# EAGLE design AutoSteerAIO (EAGLE 9.6.1)
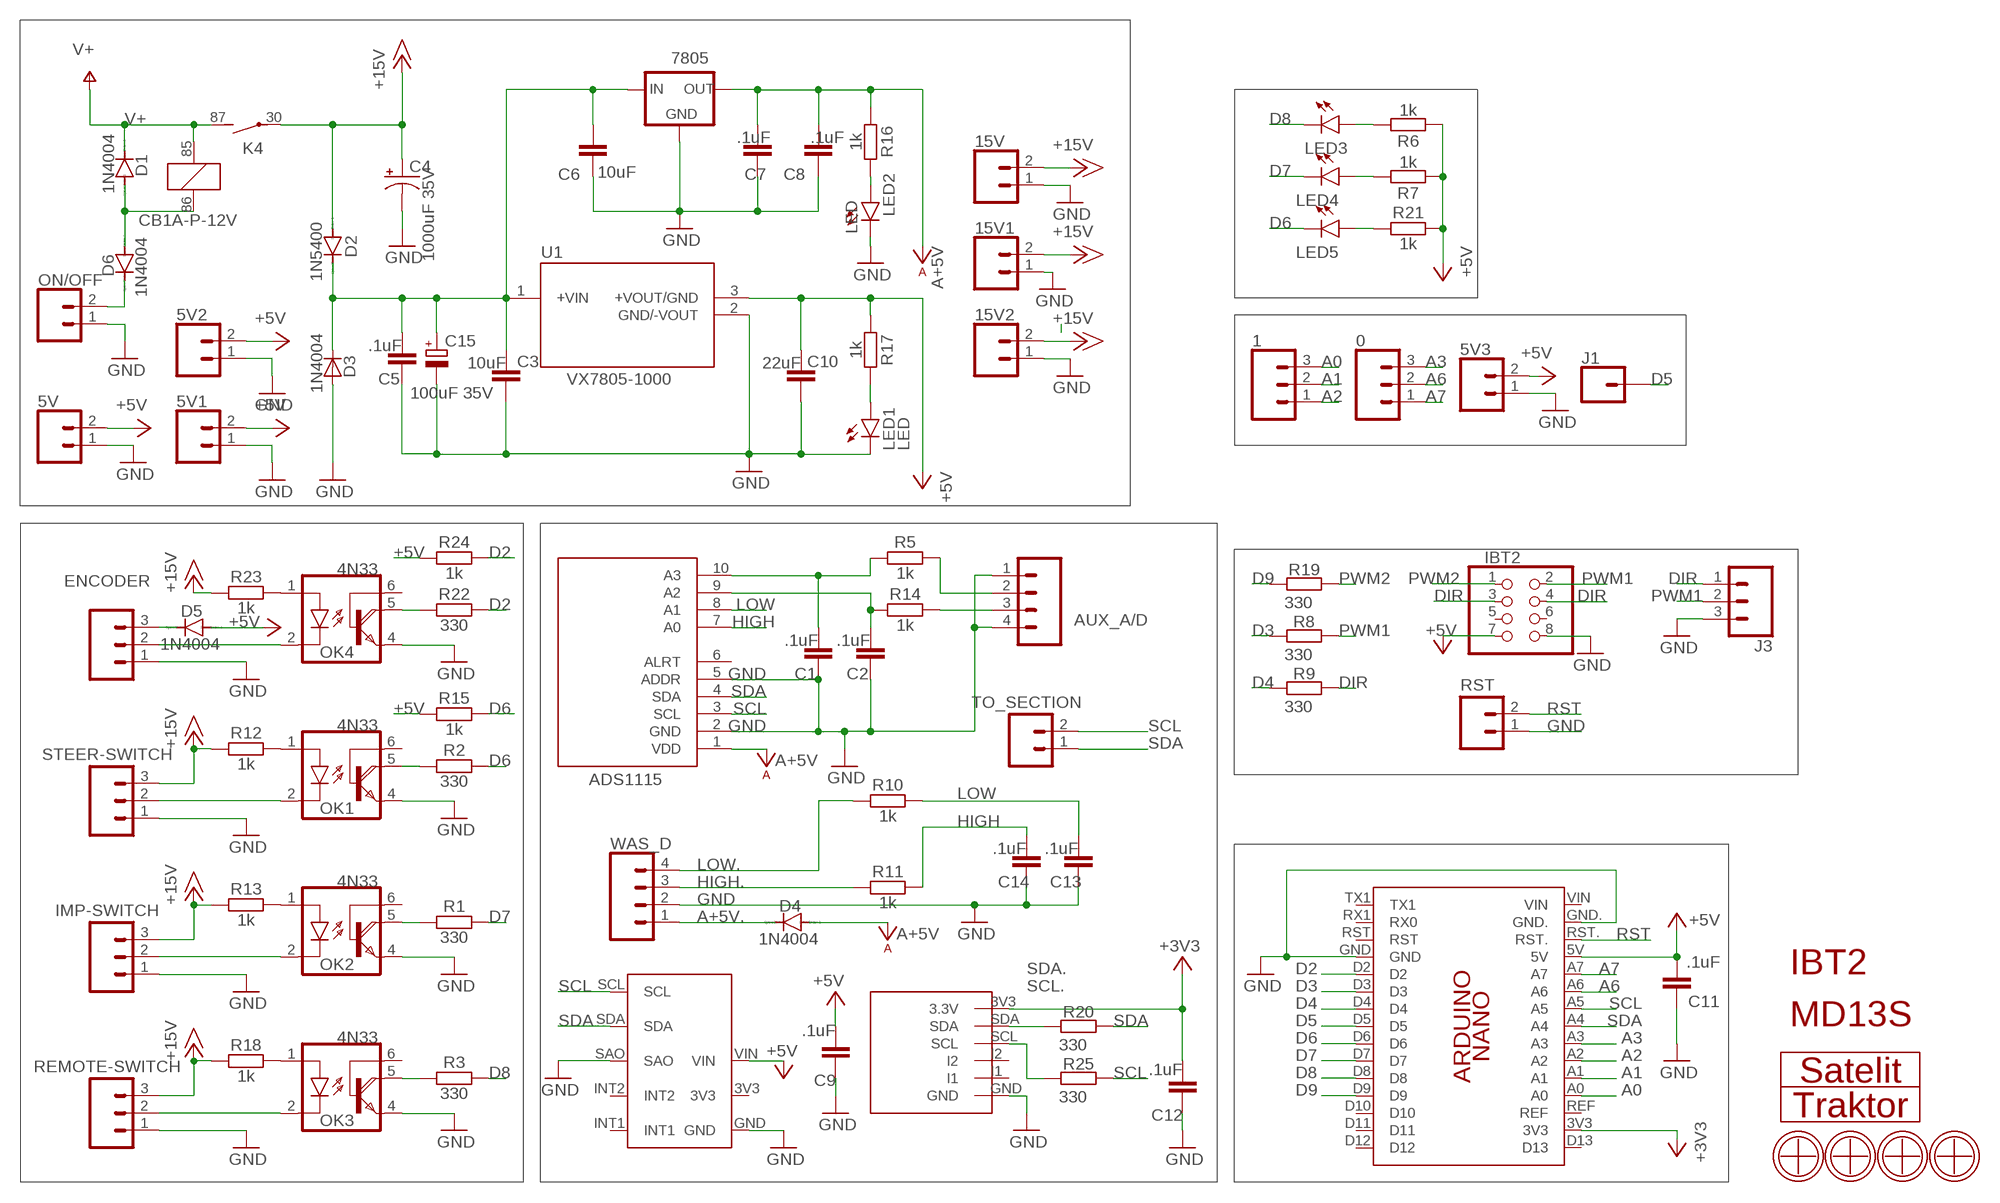
[diagram p0: schematic, sheet 1]

## Parts
0  CONNECTOR 1x2 PINS  CONN_03  [1X03]
1  CONNECTOR 1x2 PINS  CONN_03  [1X03]
5V  CONNECTOR 1x2 PINS  CONN_02  [1X02]
5V1  CONNECTOR 1x2 PINS  CONN_02  [1X02]
5V2  CONNECTOR 1x2 PINS  CONN_02  [1X02]
5V3  CONNECTOR 1x2 PINS  CONN_02  [1X02]
15V  CONNECTOR 1x2 PINS  CONN_02  [1X02]
15V1  CONNECTOR 1x2 PINS  CONN_02  [1X02]
15V2  CONNECTOR 1x2 PINS  CONN_02  [1X02]
7805  78XXS  [78XXS]
ADS1115  ADS1115  ADC-4CH-ADS1115  [ADC-4CH-ADS1115]
AUX_A/D  CONNECTOR 1x4 PINS  CONN_04  [1X04]
C1  .1uF  C-EU050-024X044  [C050-024X044]
C2  .1uF  C-EU050-024X044  [C050-024X044]
C3  10uF  C-EU050-024X044  [C050-024X044]
C4  1000uF 35V  1000UF-RADIAL-5MM-25V-20%  [CPOL-RADIAL-5MM-10MM]
C5  .1uF  C-EU050-024X044  [C050-024X044]
C6  10uF  C-EU050-024X044  [C050-024X044]
C7  .1uF  C-EU050-024X044  [C050-024X044]
C8  .1uF  C-EU050-024X044  [C050-024X044]
C9  .1uF  C-EU050-024X044  [C050-024X044]
C10  22uF  C-EU050-024X044  [C050-024X044]
C11  .1uF  C-EU050-024X044  [C050-024X044]
C12  .1uF  C-EU050-024X044  [C050-024X044]
C13  .1uF  C-EU050-024X044  [C050-024X044]
C14  .1uF  C-EU050-024X044  [C050-024X044]
C15  100uF 35V  CPOL-EUE2.5-6  [E2,5-6]
D1  1N4004  [DO41-10]
D2  1N5400  [DO201-15]
D3  1N4004  [DO41-10]
D4  1N4004  [DO41-10]
D5  1N4004  [DO41-10]
D6  1N4004  [DO41-10]
ENCODER  CONNECTOR 1x3 PINS  CONN_03  [1X03]
IBT2  PINHD-2X4  [2X04]
IMP-SWITCH  CONNECTOR 1x3 PINS  CONN_03  [1X03]
J1  CONN_01  [1X01]
J3  CONN_03  [1X03]
K4  CB1A-P-12V  [CB1]
LED1  LED  LED3MM  [LED3MM]
LED2  LED  LED3MM  [LED3MM]
LED3  LED  LED3MM  [LED3MM]
LED4  LED  LED3MM  [LED3MM]
LED5  LED  LED3MM  [LED3MM]
MMA8542  MMA8542  [MMA8452]
OK1  4N33  [DIL06]
OK2  4N33  [DIL06]
OK3  4N33  [DIL06]
OK4  4N33  [DIL06]
ON/OFF  CONNECTOR 1x2 PINS  CONN_02  [1X02]
PCB1  ARDUINO NANO v3  ARDUINO-NANO  [ARDUINO-NANO]
R1  330  R-EU_0207/7  [0207/7]
R2  330  R-EU_0207/7  [0207/7]
R3  330  R-EU_0207/7  [0207/7]
R5  1k  R-EU_0207/7  [0207/7]
R6  1k  R-EU_0207/7  [0207/7]
R7  1k  R-EU_0207/7  [0207/7]
R8  330  R-EU_0207/7  [0207/7]
R9  330  R-EU_0207/7  [0207/7]
R10  1k  R-EU_0207/7  [0207/7]
R11  1k  R-EU_0207/7  [0207/7]
R12  1k  R-EU_0207/7  [0207/7]
R13  1k  R-EU_0207/7  [0207/7]
R14  1k  R-EU_0207/7  [0207/7]
R15  1k  R-EU_0207/7  [0207/7]
R16  1k  R-EU_0207/7  [0207/7]
R17  1k  R-EU_0207/7  [0207/7]
R18  1k  R-EU_0207/7  [0207/7]
R19  330  R-EU_0207/7  [0207/7]
R20  330  R-EU_0207/7  [0207/7]
R21  1k  R-EU_0207/7  [0207/7]
R22  330  R-EU_0207/7  [0207/7]
R23  1k  R-EU_0207/7  [0207/7]
R24  1k  R-EU_0207/7  [0207/7]
R25  330  R-EU_0207/7  [0207/7]
REMOTE-SWITCH  CONNECTOR 1x3 PINS  CONN_03  [1X03]
RST  CONNECTOR 1x2 PINS  CONN_02  [1X02]
STEER-SWITCH  CONNECTOR 1x3 PINS  CONN_03  [1X03]
TO_SECTION  CONNECTOR 1x2 PINS  CONN_02  [1X02]
U1  VX7805-1000  [VX78012-1000_VX7805-1000]
U$1  MD13S  [MD13S]
U$2  IBT2  [IBT2]
U$5  TRAKTOR-MALI  [TRAKTOR-MALI]
U$6  4.2MM-6MM  [4.2MM-6MM]
U$7  4.2MM-6MM  [4.2MM-6MM]
U$8  SATELIT-MALI  [SATELIT-MALI]
U$9  4.2MM-6MM  [4.2MM-6MM]
U$10  4.2MM-6MM  [4.2MM-6MM]
U$13  MMA8542Q  [MMA8542Q]
WAS_D  CONNECTOR 1x4 PINS  CONN_04  [1X04]

## Nets
+3V3: C12.2 PCB1.3V3 U$13.3V3(3.3V)
+5V: 5V1.2 5V2.2 5V3.2 5V.2 C9.2 C10.2 C11.2 D5.A IBT2.7 MMA8542.VIN PCB1.5V R6.1 R7.1 R15.1 R17.1 R21.2 R24.1 U1.3(+VOUT/GND)
+15V: 15V1.2 15V2.2 15V.2 C4.+ D2.A IMP-SWITCH.3 K4.30(2:P) R12.1 R13.1 R18.1 R23.1 REMOTE-SWITCH.3 STEER-SWITCH.3
A0: 1.3 PCB1.A0
A1: 1.2 PCB1.A1
A2: 1.1 PCB1.A2
A3: 0.3 PCB1.A3
A6: 0.2 PCB1.A6
A7: 0.1 PCB1.A7
A+5V: 7805.OUT ADS1115.1(VDD) C7.2 C8.2 D4.A R16.1
A+5V.: D4.C WAS_D.1
D2: PCB1.D2 R22.2 R24.2
D3: PCB1.D3 R8.2
D4: PCB1.D4 R9.2
D5: J1.1 PCB1.D5
D6: LED5.K(C) PCB1.D6 R2.2 R15.2
D7: LED4.K(C) PCB1.D7 R1.2
D8: LED3.K(C) PCB1.D8 R3.2
D9: PCB1.D9 R19.2
DIR: IBT2.3 IBT2.4 J3.1 R9.1
GND: 5V1.1 5V2.1 5V3.1 5V.1 15V1.1 15V2.1 15V.1 7805.GND ADS1115.2(GND) ADS1115.5(ADDR) AUX_A/D.1 AUX_A/D.4 C1.1 C2.1 C3.1 C4.- C5.1 C6.1 C7.1 C8.1 C9.1 C10.1 C11.1 C12.1 C13.1 C14.1 C15.- D3.A ENCODER.1 IBT2.8 IMP-SWITCH.1 J3.3 LED1.K(C) LED2.K(C) MMA8542.GND MMA8542.SAO OK1.4(E) OK2.4(E) OK3.4(E) OK4.4(E) ON/OFF.1 PCB1.GND PCB1.GND. REMOTE-SWITCH.1 RST.1 STEER-SWITCH.1 U1.2(GND/-VOUT) U$13.GND WAS_D.2
HIGH: ADS1115.7(A0) C14.2 R11.2
HIGH.: R11.1 WAS_D.3
LOW: ADS1115.8(A1) C13.2 R10.2
LOW.: R10.1 WAS_D.4
N$1: D5.C ENCODER.3
N$2: OK1.5(COL) R2.1
N$3: OK1.2(C) STEER-SWITCH.2
N$4: IMP-SWITCH.2 OK2.2(C)
N$5: D1.A D6.A K4.86
N$6: OK2.5(COL) R1.1
N$7: ADS1115.10(A3) C1.2 R5.1
N$8: ADS1115.9(A2) C2.2 R14.1
N$9: ENCODER.2 OK4.2(C)
N$10: AUX_A/D.2 R5.2
N$11: AUX_A/D.3 R14.2
N$12: OK3.2(C) REMOTE-SWITCH.2
N$13: LED2.A R16.2
N$14: LED1.A R17.2
N$15: OK3.5(COL) R3.1
N$16: OK2.1(A) R13.2
N$17: OK3.1(A) R18.2
N$18: OK1.1(A) R12.2
N$22: LED3.A R6.2
N$23: LED5.A R21.1
N$26: 7805.IN C3.2 C5.2 C6.2 C15.+ D2.C D3.C U1.1(+VIN)
N$28: D6.C ON/OFF.2
N$29: OK4.5(COL) R22.1
N$30: OK4.1(A) R23.2
N$31: LED4.A R7.2
PWM1: IBT2.2 J3.2 R8.1
PWM2: IBT2.1 R19.1
RST: PCB1.RST. RST.2
SCL: ADS1115.3(SCL) MMA8542.SCL PCB1.A5 R25.1 TO_SECTION.2
SCL.: R25.2 U$13.SCL
SDA: ADS1115.4(SDA) MMA8542.SDA PCB1.A4 R20.1 TO_SECTION.1
SDA.: R20.2 U$13.SDA
V+: D1.C K4.85 K4.87(2:S) ; supply symbol labelled BAT V+
Unconnected: ADS1115.6(ALRT) IBT2.5 IBT2.6 MMA8542.3V3 MMA8542.INT1 MMA8542.INT2 OK1.6(B) OK2.6(B) OK3.6(B) OK4.6(B) PCB1.D10 PCB1.D11 PCB1.D12 PCB1.D13 PCB1.REF PCB1.RST PCB1.RX1(RX0) PCB1.TX1 PCB1.VIN U$6.P$1 U$7.P$1 U$9.P$1 U$10.P$1 U$13.I1 U$13.I2

## Library data of the parts
0 1 ENCODER IMP-SWITCH J3 REMOTE-SWITCH STEER-SWITCH = SparkFun-Connectors:CONN_03: Multi connection point. Often used as Generic Header-pin footprint for 0.1 inch spaced/style header connections On any of the 0.1 inch spaced packages, you can populate with these: Break Away Headers - Straight <https://www.sparkfun.com/products/116> (PRT-00116) Break Away Male Headers - Right Angle <https://www.sparkfun.com/products/553> (PRT-00553) Female Headers <https://www.sparkfun.com/products/115> (PRT-00115) Break Away Headers - Machine Pin <https://www.sparkfun.com/products/117> (PRT-00117) Break Away Female Headers - Swiss Machine Pin <https://www.sparkfun.com/products/743> (PRT-00743) Stackable Header - 3 Pin (Female, 0.1") <https://www.sparkfun.com/products/13875> (PRT-13875) For SCREWTERMINALS and SPRING TERMINALS visit here: Screw Terimnals on SparkFun.com <https://www.sparkfun.com/search/results?term=Screw+Terminals> (5mm/3.5mm/2.54mm spacing) This device is also useful as a general connection point to wire up your design to another part of your project. Our various solder wires solder well into these plated through hole pads. Hook-Up Wire - Assortment (Stranded, 22 AWG) <https://www.sparkfun.com/products/11375> (PRT-11375) Hook-Up Wire - Assortment (Solid Core, 22 AWG) <https://www.sparkfun.com/products/11367> (PRT-11367) View the entire wire category on our website here <https://www.sparkfun.com/categories/141> Special notes: Molex polarized connector foot print use with SKU : PRT-08232 with associated crimp pins and housings.; OC_NEWARK: unknown
5V 5V1-5V3 15V 15V1 15V2 ON/OFF RST TO_SECTION = SparkFun-Connectors:CONN_02: Multi connection point. Often used as Generic Header-pin footprint for 0.1 inch spaced/style header connections On any of the 0.1 inch spaced packages, you can populate with these: Break Away Headers - Straight <https://www.sparkfun.com/products/116> (PRT-00116) Break Away Male Headers - Right Angle <https://www.sparkfun.com/products/553> (PRT-00553) Female Headers <https://www.sparkfun.com/products/115> (PRT-00115) Break Away Headers - Machine Pin <https://www.sparkfun.com/products/117> (PRT-00117) Break Away Female Headers - Swiss Machine Pin <https://www.sparkfun.com/products/743> (PRT-00743) For SCREWTERMINALS and SPRING TERMINALS visit here: Screw Terimnals on SparkFun.com <https://www.sparkfun.com/search/results?term=Screw+Terminals> (5mm/3.5mm/2.54mm spacing) This device is also useful as a general connection point to wire up your design to another part of your project. Our various solder wires solder well into these plated through hole pads. Hook-Up Wire - Assortment (Stranded, 22 AWG) <https://www.sparkfun.com/products/11375> (PRT-11375) Hook-Up Wire - Assortment (Solid Core, 22 AWG) <https://www.sparkfun.com/products/11367> (PRT-11367) View the entire wire category on our website here <https://www.sparkfun.com/categories/141> Special notes: Molex polarized connector foot print use with: PRT-08233 with associated crimp pins and housings. 2.54_SCREWTERM for use with PRT-10571. 3.5mm Screw Terminal footprints for PRT-08084 5mm Screw Terminal footprints for use with PRT-08432; OC_NEWARK: unknown
7805 = v-reg:78XXS: VOLTAGE REGULATOR
ADS1115 = #Diy-modules:ADC-4CH-ADS1115: 4 Channel 16-Bit Analog-to-Digital Converter based on ADS1115 chip Arduino ADS1115 Getting Started Tutorial is available here: http://henrysbench.capnfatz.com/henrys-bench/arduino-voltage-measurements/arduino-ads1115-module-getting-started-tutorial/ ADS1115 datasheet is available here: http://www.ti.com/lit/ds/symlink/ads1115.pdf Click here to find device on ebay.com <http://www.ebay.com/sch/ads1115+module>; OC_NEWARK: unknown
AUX_A/D WAS_D = SparkFun-Connectors:CONN_04: Multi connection point. Often used as Generic Header-pin footprint for 0.1 inch spaced/style header connections On any of the 0.1 inch spaced packages, you can populate with these: Break Away Headers - Straight <https://www.sparkfun.com/products/116> (PRT-00116) Break Away Male Headers - Right Angle <https://www.sparkfun.com/products/553> (PRT-00553) Female Headers <https://www.sparkfun.com/products/115> (PRT-00115) Break Away Headers - Machine Pin <https://www.sparkfun.com/products/117> (PRT-00117) Break Away Female Headers - Swiss Machine Pin <https://www.sparkfun.com/products/743> (PRT-00743) For SCREWTERMINALS and SPRING TERMINALS visit here: Screw Terimnals on SparkFun.com <https://www.sparkfun.com/search/results?term=Screw+Terminals> (5mm/3.5mm/2.54mm spacing) This device is also useful as a general connection point to wire up your design to another part of your project. Our various solder wires solder well into these plated through hole pads. Hook-Up Wire - Assortment (Stranded, 22 AWG) <https://www.sparkfun.com/products/11375> (PRT-11375) Hook-Up Wire - Assortment (Solid Core, 22 AWG) <https://www.sparkfun.com/products/11367> (PRT-11367) View the entire wire category on our website here <https://www.sparkfun.com/categories/141> Special notes: Molex polarized connector foot print use with SKU : PRT-08231 with associated crimp pins and housings. 1MM SMD Version SKU: PRT-10208; OC_NEWARK: unknown; PROD_ID: CONN-09696
C1-C3 C5-C14 = resistor:C-EU: CAPACITOR, European symbol; OC_NEWARK: unknown
C4 = SparkFun-Capacitors:1000UF: 1,000µF/1mF ceramic capacitors A capacitor is a passive two-terminal electrical component used to store electrical energy temporarily in an electric field. CAP-08070; OC_NEWARK: unknown; PROD_ID: CAP-09538; VALUE: 1mF
C15 = rcl:CPOL-EU: POLARIZED CAPACITOR, European symbol; SPICEPREFIX: C
D1 D4-D6 = #Diode 2:1N4004: DIODE; OC_NEWARK: unknown
D2 = #Diode 2:1N5400: DIODE standard rectifier, 3 A, 50 V (Motorola); OC_NEWARK: unknown
D3 = #adafruit:1N4004: DIODE; OC_NEWARK: unknown
IBT2 = #pinhead:PINHD-2X4: PIN HEADER; OC_NEWARK: unknown
J1 = SparkFun-Connectors:CONN_01: Single connection point. Often used as Generic Header-pin footprint for 0.1 inch spaced/style header connections On any of the 0.1 inch spaced packages, you can populate with these: Break Away Headers - Straight <https://www.sparkfun.com/products/116> (PRT-00116) Break Away Male Headers - Right Angle <https://www.sparkfun.com/products/553> (PRT-00553) Female Headers <https://www.sparkfun.com/products/115> (PRT-00115) Break Away Headers - Machine Pin <https://www.sparkfun.com/products/117> (PRT-00117) Break Away Female Headers - Swiss Machine Pin <https://www.sparkfun.com/products/743> (PRT-00743) This device is also useful as a general connection point to wire up your design to another part of your project. Our various solder wires solder well into these plated through hole pads. Hook-Up Wire - Assortment (Stranded, 22 AWG) <https://www.sparkfun.com/products/11375> (PRT-11375) Hook-Up Wire - Assortment (Solid Core, 22 AWG) <https://www.sparkfun.com/products/11367> (PRT-11367) View the entire wire category on our website here <https://www.sparkfun.com/categories/141> Special notes: SMTSO-256-ET is a "flush mount" nut for a 4-40 screw. We mostly use this on specialty testbeds; it is a nice way to connect hardware to your PCB at an adjustable hieght. Also note, the SNAP packages are for using a snappable style connector. We sell a baggie of snaps and they are also used on two LilyPad designs: Snap Assortment - 30 pack (male and female) <https://www.sparkfun.com/products/11347> (DEV-11347) LilyPad Arduino SimpleSnap <https://www.sparkfun.com/products/10941> (DEV-10941) LilyPad SimpleSnap Protoboard <https://www.sparkfun.com/products/10940> (DEV-10940)
K4 = #relay:CB*: HIGH POWER AUTOMOTIVE RELAY Form A NAiS Source: http://www.mew-europe.com/.. en_ds_61202_0000.pdf
LED1-LED5 = led:LED: LED OSRAM: - CHIPLED LG R971, LG N971, LY N971, LG Q971, LY Q971, LO R971, LY R971 LH N974, LH R974 LS Q976, LO Q976, LY Q976 LO Q996 - Hyper CHIPLED LW Q18S LB Q993, LB Q99A, LB R99A - SideLED LS A670, LO A670, LY A670, LG A670, LP A670 LB A673, LV A673, LT A673, LW A673 LH A674 LY A675 LS A676, LA A676, LO A676, LY A676, LW A676 LS A679, LY A679, LG A679 - Hyper Micro SIDELED® LS Y876, LA Y876, LO Y876, LY Y876 LT Y87S - SmartLED LW L88C, LW L88S LB L89C, LB L89S, LG L890 LS L89K, LO L89K, LY L89K LS L896, LA L896, LO L896, LY L896 - TOPLED LS T670, LO T670, LY T670, LG T670, LP T670 LSG T670, LSP T670, LSY T670, LOP T670, LYG T670 LG T671, LOG T671, LSG T671 LB T673, LV T673, LT T673, LW T673 LH T674 LS T676, LA T676, LO T676, LY T676, LB T676, LH T676, LSB T676, LW T676 LB T67C, LV T67C, LT T67C, LS T67K, LO T67K, LY T67K, LW E67C LS E67B, LA E67B, LO E67B, LY E67B, LB E67C, LV E67C, LT E67C LW T67C LS T679, LY T679, LG T679 LS T770, LO T770, LY T770, LG T770, LP T770 LB T773, LV T773, LT T773, LW T773 LH T774 LS E675, LA E675, LY E675, LS T675 LS T776, LA T776, LO T776, LY T776, LB T776 LHGB T686 LT T68C, LB T68C - Hyper Mini TOPLED® LB M676 - Mini TOPLED Santana® LG M470 LS M47K, LO M47K, LY M47K Source: http://www.osram.convergy.de LUXEON: - LUMILED® LXK2-PW12-R00, LXK2-PW12-S00, LXK2-PW14-U00, LXK2-PW14-V00 LXK2-PM12-R00, LXK2-PM12-S00, LXK2-PM14-U00 LXK2-PE12-Q00, LXK2-PE12-R00, LXK2-PE12-S00, LXK2-PE14-T00, LXK2-PE14-U00 LXK2-PB12-K00, LXK2-PB12-L00, LXK2-PB12-M00, LXK2-PB14-N00, LXK2-PB14-P00, LXK2-PB14-Q00 LXK2-PR12-L00, LXK2-PR12-M00, LXK2-PR14-Q00, LXK2-PR14-R00 LXK2-PD12-Q00, LXK2-PD12-R00, LXK2-PD12-S00 LXK2-PH12-R00, LXK2-PH12-S00 LXK2-PL12-P00, LXK2-PL12-Q00, LXK2-PL12-R00 Source: www.luxeon.com KINGBRIGHT: KA-3528ASYC Source: www.kingbright.com; OC_NEWARK: unknown
MMA8542 = #MMA8542:MMA8542; OC_NEWARK: unknown
OK1-OK4 = #optocoupler:4N33: https://www.snapeda.com/parts/4N33SR2M/ON%20Semiconductor/datasheet/; MF: VISHAY/TELEFUNKEN; MPN: 4N33; OC_FARNELL: 1469601; OC_NEWARK: 88K1390
PCB1 = #Arduino:ARDUINO-NANO: Device for representing an Arduino Nano board with a footprint in an EAGLE design.; OC_NEWARK: unknown
R1-R3 R5-R25 = resistor:R-EU_: RESISTOR, European symbol; OC_NEWARK: unknown
U1 = #VX7805-1000:VX7805-1000; CUI_PURCHASE_URL: https://www.cui.com/product/power/dc-dc-converters/non-isolated/1-a-output-current/vx78-1000-series?utm_source=snapeda.com&utm_medium=referral&utm_campaign=snapedaBOM; DESCRIPTION: Module DC-DC 24V/12VIN 2-OUT 5V/-5V 1A/-0.5A 5W 3-Pin SIP Module Tube; DIGI-KEY_PART_NUMBER: 102-4253-ND; DIGI-KEY_PURCHASE_URL: https://www.digikey.rs/product-detail/en/cui-inc/VX7805-1000/102-4253-ND/7350292?utm_source=snapeda&utm_medium=aggregator&utm_campaign=symbol; MP: VX7805-1000; OC_NEWARK: unknown; PACKAGE: SIP-3 CUI
U$1 = #Motor Drivers:MD13S: 13Amp DC Motor Driver (MD13S) Created by: Wai Weng
U$2 = #Motor Drivers:IBT2
U$5 = #Logo:TRAKTOR-MALI; OC_NEWARK: unknown
U$6 U$7 U$9 U$10 = #Holes:4.2MM-6MM; OC_NEWARK: unknown
U$8 = #Logo:SATELIT-MALI; OC_NEWARK: unknown
U$13 = #MMA8542Q:MMA8542Q

## Board
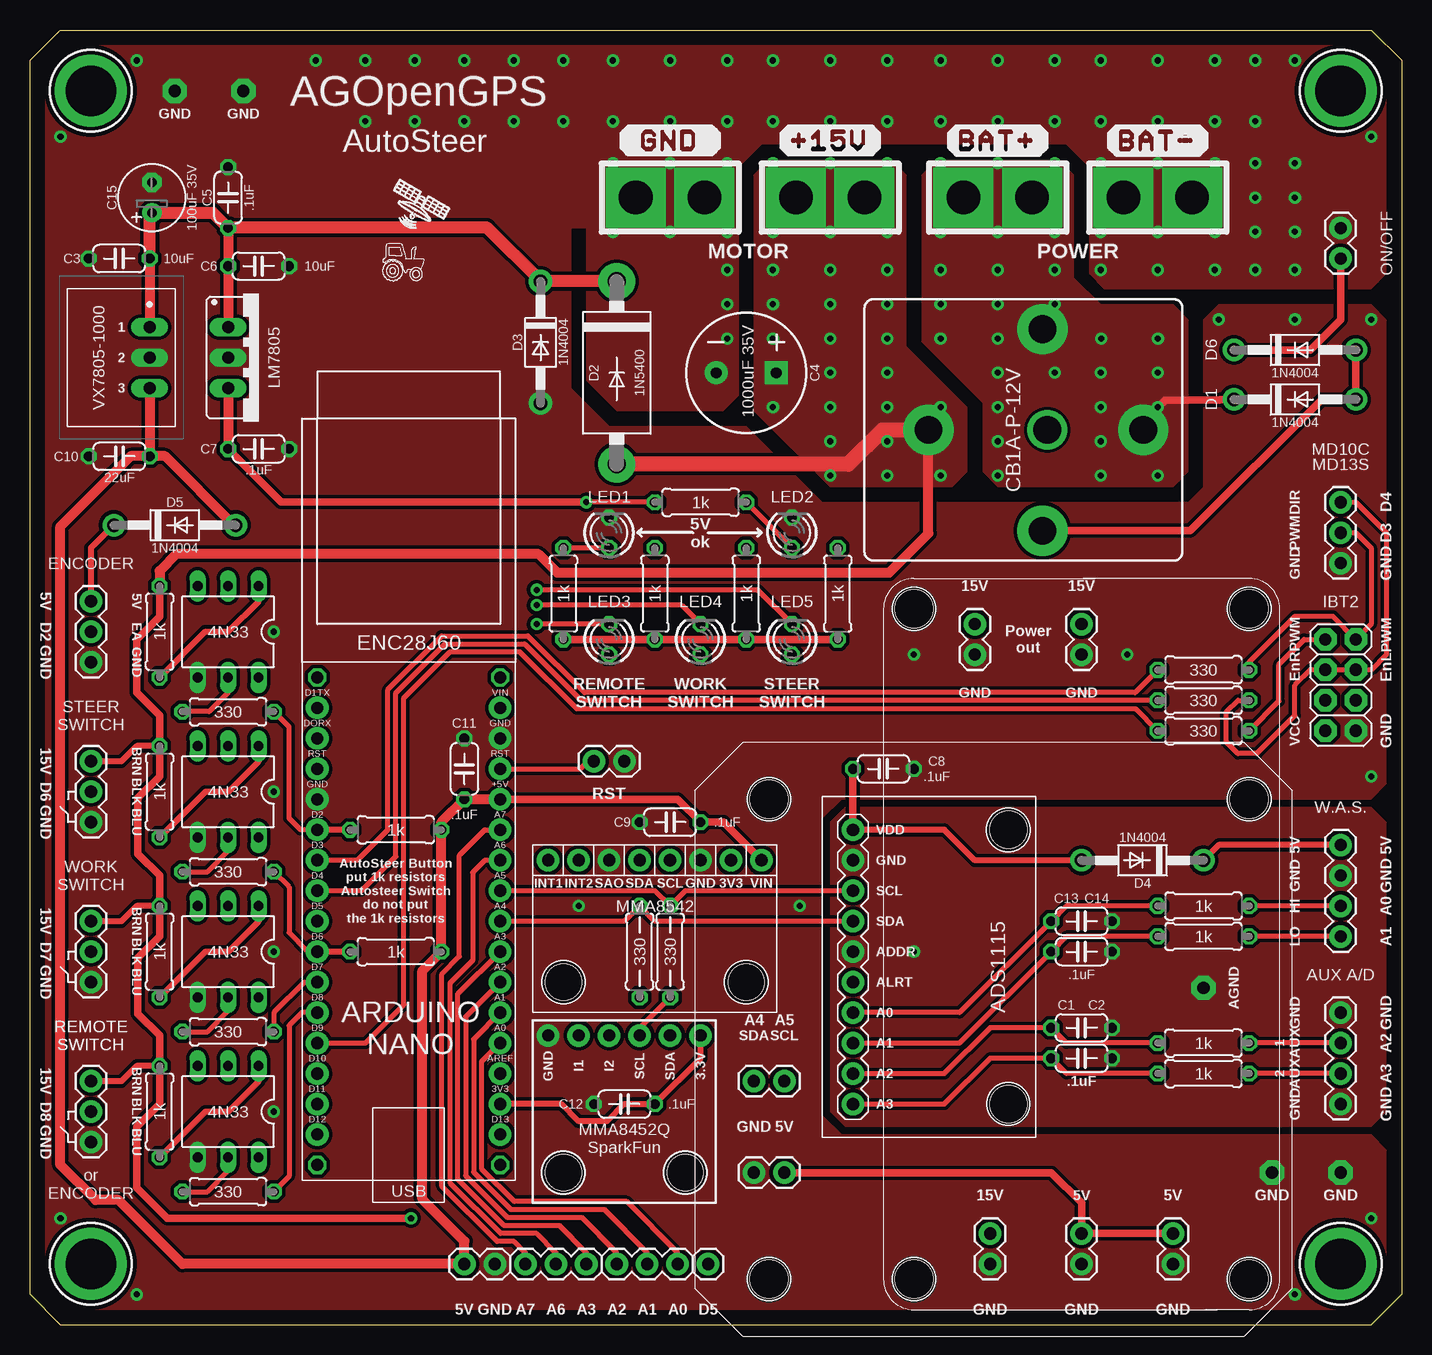
[diagram p1: board, top side]
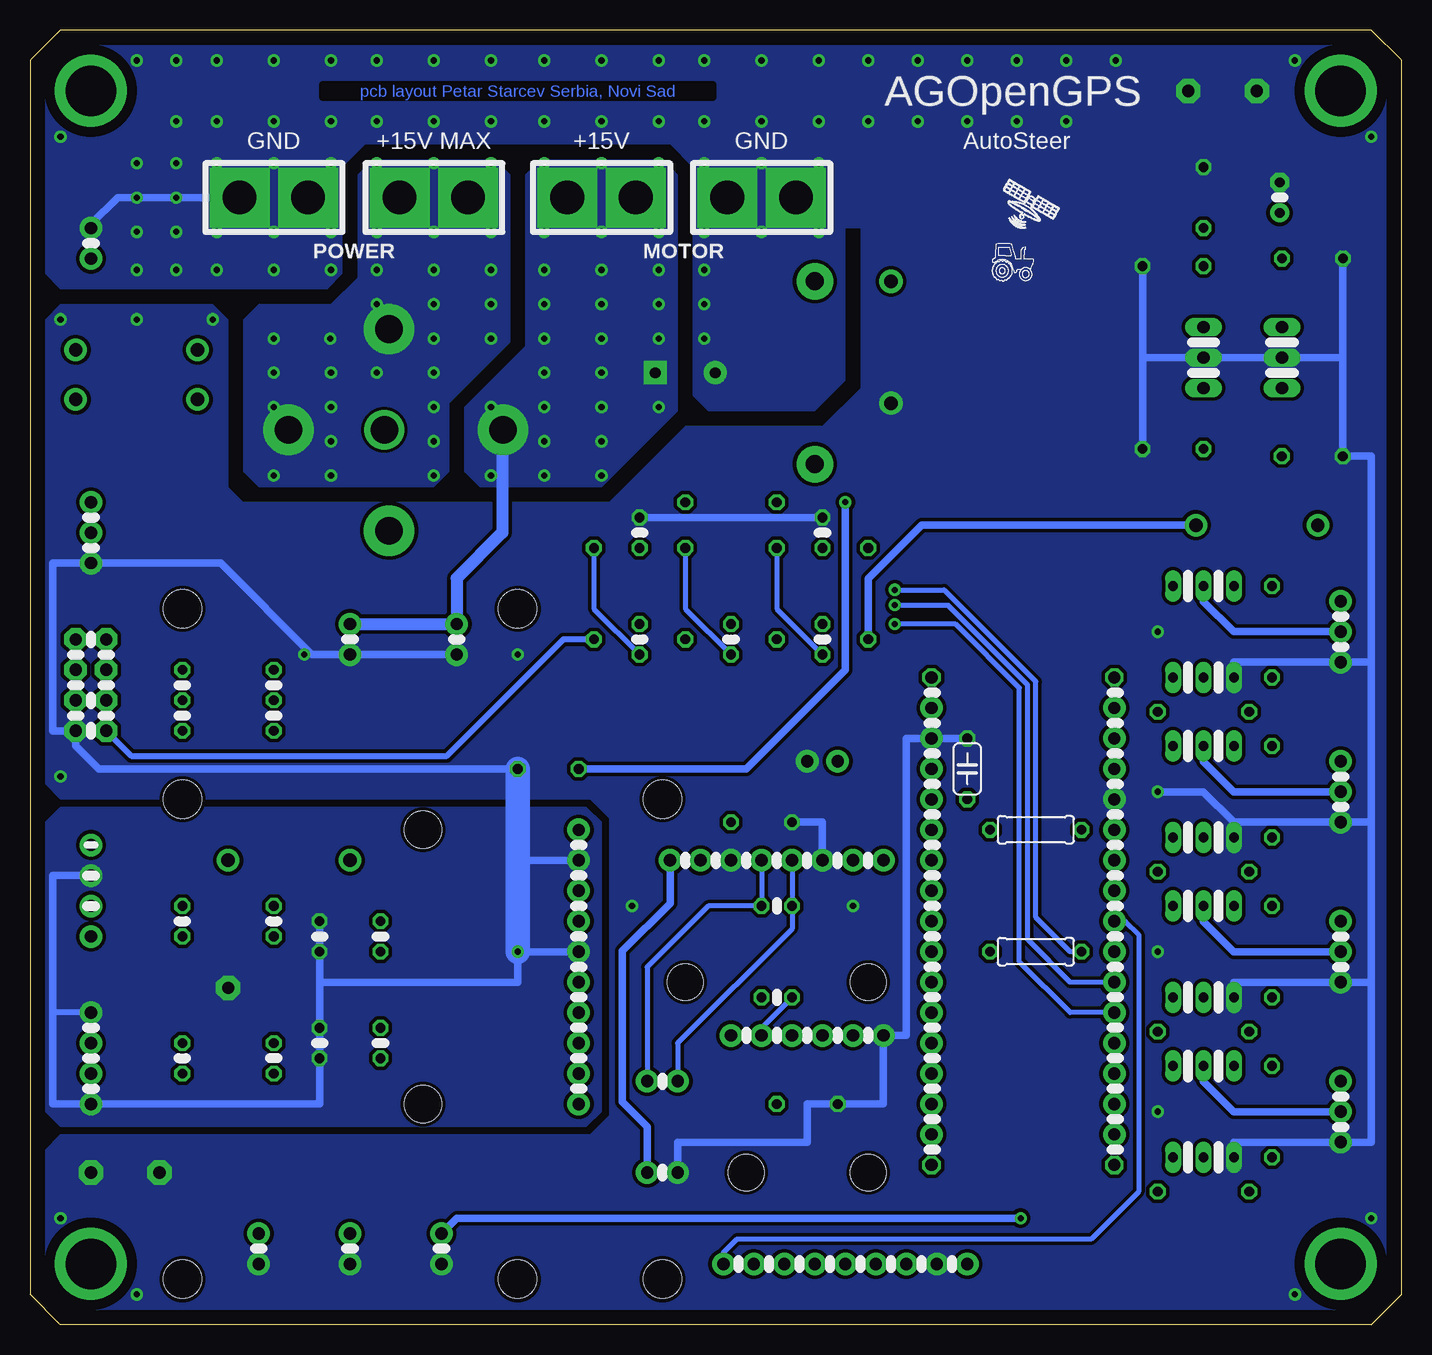
[diagram p2: board, bottom side, seen from below]

Size 114.3 x 107.95 mm. Coordinates in mm from the lower left corner, seen from the top.
Outline: 114.3,105.41 114.3,2.54 111.76,0 2.54,0 0,2.54 0,105.41 2.54,107.95 111.76,107.95 114.3,105.41
Copper layers (1*16): Top 0.035mm / dielectric 1.5mm / Bottom 0.035mm
Design rules "SparkFun-2-layer-STANDARD": minimum track width 10mil, minimum drill 20mil, track to track 10mil, track to pad 8mil, pad to pad 8mil, via to via 10mil, smd to smd 8mil, copper to edge 8mil, drill to drill 8mil, minimum pad ring 10mil, minimum via ring 10mil, stop-mask expansion 4mil, vias tented up to drill 25mil, thermal gap 10mil
Holes 3.2 mm at 61.59,3.81 73.66,3.81 101.6,3.81 101.6,43.81 61.59,43.81 101.6,59.69 73.66,59.69

### Footprints (pad centres in the part's own frame; a part is rotated, then mirrored left to right if it is on the bottom)
1X03 = drill 1.016 pad 1.88: 1 0,0; 2 2.54,0; 3 5.08,0
1X02 = drill 1.016 pad 1.88: 1 0,0; 2 2.54,0
78XXS = drill 1.016 long: GND 0,-2.54; IN -2.54,-2.54; OUT 2.54,-2.54
ADC-4CH-ADS1115 = drill 1.016 pad 1.88: 1 -6.35,11.43; 2 -6.35,8.89; 3 -6.35,6.35; 4 -6.35,3.81; 5 -6.35,1.27; 6 -6.35,-1.27; 7 -6.35,-3.81; 8 -6.35,-6.35; 9 -6.35,-8.89; 10 -6.35,-11.43 | hole 3.1: 6.604,11.43; 6.604,-11.43
1X04 = drill 1.016 pad 1.88: 1 0,0; 2 2.54,0; 3 5.08,0; 4 7.62,0
C050-024X044 = drill 0.813 octagon: 1 -2.54,0; 2 2.54,0
CPOL-RADIAL-5MM-10MM = drill 0.9 pad 1.93 square: + 2.5,0 | drill 0.9 pad 1.93: - -2.5,0
E2,5-6 = drill 0.813 pad 1.6: + -1.27,0 | drill 0.813 pad 1.6 octagon: - 1.27,0
DO41-10 = drill 1.118 pad 1.88: A 5.08,0; C -5.08,0
DO201-15 = drill 1.499 pad 3.048: A 7.62,0; C -7.62,0
DO41-10' = drill 1.118 pad 1.93: A 5.08,0; C -5.08,0
2X04 = drill 1.016 pad 1.88 octagon: 1 -3.81,-1.27; 2 -3.81,1.27; 3 -1.27,-1.27; 4 -1.27,1.27; 5 1.27,-1.27; 6 1.27,1.27; 7 3.81,-1.27; 8 3.81,1.27
1X01 = drill 1.016 pad 1.88: 1 0,0
CB1 = drill 2.3 pad 4.2: 30 8.95,0; 85 -0.55,-8.4; 86 -0.55,8.4; 87 -8.95,0 | drill 2.3: 87A -0.95,0
LED3MM = drill 0.813 octagon: A -1.27,0; K 1.27,0
MMA8452 = drill 1.016 pad 1.88: 3V3 16.51,12.7; GND 13.97,12.7; INT1 1.27,12.7; INT2 3.81,12.7; SAO 6.35,12.7; SCL 11.43,12.7; SDA 8.89,12.7; VIN 19.05,12.7 | hole 3: 2.54,2.54; 17.78,2.54
DIL06 = drill 0.813 long: 1 -2.54,-3.81; 2 0,-3.81; 3 2.54,-3.81; 4 2.54,3.81; 5 0,3.81; 6 -2.54,3.81
ARDUINO-NANO = drill 1.016 pad 1.88: 3V3 -15.24,-7.62; 5V 10.16,-7.62; A0 -10.16,-7.62; A1 -7.62,-7.62; A2 -5.08,-7.62; A3 -2.54,-7.62; A4 0,-7.62; A5 2.54,-7.62; A6 5.08,-7.62; A7 7.62,-7.62; D2 7.62,7.62; D3 5.08,7.62; D4 2.54,7.62; D5 0,7.62; D6 -2.54,7.62; D7 -5.08,7.62; D8 -7.62,7.62; D9 -10.16,7.62; D10 -12.7,7.62; D11 -15.24,7.62; D12 -17.78,7.62; D13 -17.78,-7.62; GND 10.16,7.62; GND. 15.24,-7.62; REF -12.7,-7.62; RST 12.7,7.62; RST. 12.7,-7.62; RX1 15.24,7.62; TX1 17.78,7.62; VIN 17.78,-7.62 | drill 1.016 octagon: P$1 20.32,7.62; P$2 20.32,-7.62; P$3 -20.32,7.62; P$4 -20.32,-7.62
0207/7 = drill 0.813 octagon: 1 -3.81,0; 2 3.81,0
VX78012-1000_VX7805-1000 = drill 1.016 long: 1 -2.54,2.35; 2 0,2.35; 3 2.54,2.35
4.2MM-6MM = drill 4.2 pad 6: P$1 0,0
MMA8542Q = drill 1.016 pad 1.88: 3V3 13.97,1.27; GND 13.97,13.97; I1 13.97,11.43; I2 13.97,8.89; SCL 13.97,6.35; SDA 13.97,3.81 | hole 3: 2.54,2.54; 2.54,12.7

### Placement (x,y rotation side)
0  41.27,5.08 0 top
1  48.9,5.08 0 top
5V  95.25,5.08 90 top
5V1  60.33,12.7 0 top
5V2  87.63,5.08 90 top
5V3  38.73,5.08 180 top
15V  80.01,5.08 90 top
15V1  78.74,55.88 90 top
15V2  87.63,55.88 90 top
7805  19.05,80.64 270 top
ADS1115  74.93,29.84 0 top
AUX_A/D  109.22,18.41 90 top
C1  87.63,22.23 180 top
C2  87.63,24.77 180 top
C3  7.43,88.9 0 top
C4  59.69,79.38 0 top
C5  16.51,93.98 270 top
C6  19.05,88.27 180 top
C7  19.05,73.03 180 top
C8  71.12,46.35 180 top
C9  53.34,41.91 0 top
C10  7.44,72.42 0 top
C11  36.2,46.35 270 top
C12  49.53,18.41 0 top
C13  87.63,31.11 180 top
C14  87.63,33.66 180 top
C15  10.16,93.98 90 top
D1  105.41,77.15 0 top
D2  48.9,79.38 270 top
D3  1N4004  [DO41-10']  42.55,81.92 270 top
D4  92.71,38.73 180 top
D5  12.06,66.67 0 top
D6  105.41,81.28 0 top
ENCODER  5.08,55.24 90 top
IBT2  109.22,53.34 270 top
IMP-SWITCH  5.08,28.57 90 top
J1  56.52,5.08 0 top
J3  109.22,68.58 270 top
K4  83.82,74.61 180 top
LED1  48.26,66.04 90 top
LED2  63.5,66.04 90 top
LED3  48.26,57.15 90 top
LED4  55.88,57.15 90 top
LED5  63.5,57.15 90 top
MMA8542  41.91,26.04 0 top
OK1  16.51,44.45 180 top
OK2  16.51,31.11 180 top
OK3  16.51,17.78 180 top
OK4  16.51,57.78 180 top
ON/OFF  109.22,91.44 270 top
PCB1  31.56,33.66 90 top
R1  16.51,24.45 0 top
R2  16.51,37.78 0 top
R3  16.51,11.11 0 top
R5  97.79,20.95 0 top
R6  52.07,60.96 90 top
R7  59.69,60.96 90 top
R8  97.79,54.61 180 top
R9  97.79,52.07 180 top
R10  97.79,32.38 180 top
R11  97.79,34.92 180 top
R12  10.79,44.45 270 top
R13  10.79,31.11 270 top
R14  97.79,23.5 0 top
R15  30.48,31.11 180 top
R16  55.88,68.58 0 top
R17  44.45,60.96 90 top
R18  10.79,17.78 270 top
R19  97.79,49.53 180 top
R20  50.8,31.11 270 top
R21  67.31,60.96 270 top
R22  16.51,51.12 0 top
R23  10.79,57.78 270 top
R24  30.48,41.27 180 top
R25  53.34,31.11 270 top
REMOTE-SWITCH  5.08,15.24 90 top
RST  49.53,46.99 180 top
STEER-SWITCH  5.08,41.91 90 top
TO_SECTION  60.33,20.32 0 top
U1  7.62,80.64 270 top
U$1  101.6,3.81 90 top
U$2  101.6,3.81 90 top
U$5  31.11,88.27 0 top
U$6  5.08,102.87 0 top
U$7  5.08,5.08 0 top
U$8  32.38,93.34 0 top
U$9  109.22,5.08 0 top
U$10  109.22,102.87 0 top
U$11  SATELIT-MALI  [SATELIT-MALI]  31.11,93.34 0 bottom
U$12  TRAKTOR-MALI  [TRAKTOR-MALI]  32.38,88.27 0 bottom
U$13  57.15,10.16 90 top
WAS_D  109.22,40.01 270 top

### Tracks (layer width: path | path; a pad name or v marks a point on that pad's centre or on a via)
+3V3
  Top 0.508: PCB1.3V3 44.26,18.41 45.69,16.99 48.1,16.99 49.53,18.41 C12.2 55.88,22.23 U$13.3V3
+5V
  Top 0.61: R17.1 R6.1 R7.1 R21.2 | 5V1.2 85.09,12.7 87.63,10.16 5V2.2 5V.2 | PCB1.5V 53.98,43.81 C9.2 57.78,41.91 MMA8542.VIN
  Top 0.813: C10.2 8.39,72.42 2.54,66.56 2.54,13.34 5.46,10.41 7.37,10.41 12.7,5.08 5V3.2 36.2,6.99 32.7,10.48 32.7,29.53 R15.1 R24.1 34.29,41.91 C11.2 PCB1.5V | U1.3 C10.2 | D5.A 16.99,66.67 11.25,72.42 C10.2
  Bottom 0.508: IBT2.7 105.86,47.43 79.57,47.43 69.85,57.15 R21.2
  Bottom 0.61: MMA8542.VIN 60.96,35.15 64.95,31.16 64.95,18.59 62.87,16.51 5V1.2 | R17.1 44.45,62.23 40.01,66.67 D5.A
+15V  (via drill 0.51, 2.8 pad 5)
  Top 0.508: R12.1 8.89,48.26 7.62,46.99 STEER-SWITCH.3 | R13.1 8.89,34.92 7.62,33.66 IMP-SWITCH.3 | R18.1 8.89,21.59 7.62,20.32 REMOTE-SWITCH.3
  Top 0.61: R23.1 10.79,59.05 8.89,57.15 8.89,52.7 10.79,50.8 R12.1 10.79,45.72 8.99,43.92 8.99,39.27 10.79,37.47 R13.1 10.79,32.38 8.99,30.58 8.99,25.93 10.79,24.13 R18.1 10.79,18.41 8.89,16.51 8.89,11.43 11.43,8.89 v31.75,8.89
  Top 0.813: R23.1 10.79,62.87 12.19,64.26 42.39,64.26 43.94,62.71 71.6,62.71 74.87,65.98 K4.30
  Top 1.27: K4.30 71.06,74.61 68.2,71.75 D2.A
  Bottom 0.61: v31.75,8.89 78.74,8.89 15V.2
  Bottom 1.016: K4.30 74.93,74.55 74.93,66.04 78.74,62.23 15V1.2 15V2.2
  other vias: 71.44,73.66 66.67,76.52 66.67,73.66 71.44,76.52 71.44,79.38 66.67,79.38 66.67,82.23 66.67,96.84 71.44,70.8 66.67,70.8 75.88,70.8 61.91,76.52 69.53,93.98 63.82,93.98 61.91,82.23 71.44,82.23 71.44,96.84 61.91,96.84 75.88,76.52 61.91,91.12 66.67,91.12 71.44,91.12 61.91,85.09 66.67,85.09 71.44,85.09 61.91,87.95 66.67,87.95 71.44,87.95
  pour Top (isolate 0.305, no thermals): 66.67,69.85 60.33,76.2 60.33,95.89 61.59,97.16 71.75,97.16 73.03,95.89 73.03,81.6 78.11,76.52 78.11,71.12 76.83,69.85
  pour Bottom (isolate 0.305, no thermals): 66.67,69.85 60.33,76.2 60.33,95.89 61.59,97.16 71.75,97.16 73.03,95.89 73.03,81.6 78.11,76.52 78.11,71.12 76.83,69.85
A0
  Top 0.406: PCB1.A0 37.62,21.94 37.62,13.02 40.35,10.29 49.72,10.29 53.98,6.03 1.3
A1
  Top 0.406: PCB1.A1 36.96,23.82 36.96,12.74 40.08,9.62 47.85,9.62 51.44,6.03 1.2
A2
  Top 0.406: PCB1.A2 36.3,25.7 36.3,12.44 39.79,8.95 45.97,8.95 48.9,6.03 1.1
A3
  Top 0.406: PCB1.A3 35.64,27.58 35.64,12.14 39.5,8.29 44.1,8.29 46.35,6.03 0.3
A6
  Top 0.406: PCB1.A6 37.91,38.73 36.88,37.71 36.88,30.37 34.98,28.47 34.98,11.85 39.21,7.62 42.23,7.62 43.81,6.03 0.2
A7
  Top 0.406: 0.1 41.27,6.03 40.35,6.96 38.92,6.96 34.31,11.56 34.31,29.23 35.78,30.7 35.78,39.15 37.91,41.27 PCB1.A7
A+5V  (via drill 0.51)
  Top 0.406: R16.1 v46.35,68.58
  Top 0.508: D4.A 78.74,38.73 76.2,41.27 ADS1115.1
  Top 0.61: C8.2 ADS1115.1 | v46.35,68.58 20.95,68.58 C7.2
  Top 0.813: 7805.OUT C7.2
  Bottom 0.61: v46.35,68.58 46.35,54.61 54.61,46.35 C8.2
A+5V.
  Top 0.508: WAS_D.1 99.06,40.01 D4.C
D2
  Top 0.406: PCB1.D2 22.54,41.27 21.59,42.23 21.59,49.85 R22.2
  Top 0.508: R24.2 PCB1.D2
D3
  Top 0.406: PCB1.D3 27.28,38.73 29.82,41.27 29.82,52.96 34.3,57.44 41.49,57.44 46.21,52.72 92.09,52.72 R8.2
D4
  Top 0.406: PCB1.D4 27.62,36.2 30.48,39.05 30.48,52.68 34.58,56.78 41.21,56.78 45.94,52.06 93.67,52.06 93.69,52.07 R9.2
D5
  Bottom 0.406: PCB1.D5 23.02,33.66 21.91,32.54 21.91,11.11 25.88,7.14 55.4,7.14 56.52,6.03 J1.1
D6  (via drill 0.51)
  Top 0.406: PCB1.D6 23.18,31.11 21.59,32.7 21.59,36.51 R2.2 | v42.23,61.28 60.64,61.28 LED5.K
  Top 0.508: R15.2 PCB1.D6
  Bottom 0.406: R15.2 27.62,31.11 30.48,33.97 30.48,53.63 38.12,61.28 v42.23,61.28
D7  (via drill 0.51)
  Top 0.406: PCB1.D7 22.86,28.57 20.32,26.04 R1.2 | v42.23,60.01 54.29,60.01 LED4.K
  Bottom 0.406: PCB1.D7 27.62,28.57 31.17,32.12 31.17,53.36 37.81,60.01 v42.23,60.01
D8  (via drill 0.51)
  Top 0.406: R3.2 21.59,12.38 21.59,24.96 22.67,26.04 PCB1.D8 | LED3.K v42.23,58.42
  Bottom 0.406: PCB1.D8 27.62,26.04 31.85,30.26 31.85,53.11 37.16,58.42 v42.23,58.42
D9
  Top 0.406: PCB1.D9 27.96,23.5 31.17,26.7 31.17,52.28 34.98,56.1 40.82,56.1 45.55,51.37 92.14,51.37 R19.2
DIR
  Top 0.406: R9.1 100.65,52.07 99.69,51.12 99.69,48.58 100.65,47.62 102.23,47.62 105.41,50.8 105.41,53.34 106.68,54.61 IBT2.3 IBT2.4 111.76,54.61 113.03,55.88 113.03,66.04 110.49,68.58 J3.1
GND  (via drill 0.51, 1.02 pad 2.03, 2.8 pad 5)
  Bottom 0.508: 112.39,36.51 112.39,26.04 | 112.39,26.04 112.39,20 | AUX_A/D.4 112.39,26.04
  Bottom 0.61: 90.17,28.57 C13.1 C14.1 | 90.17,28.57 C2.1 C1.1 90.17,18.41 AUX_A/D.1 112.39,18.41 112.39,20 112.39,36.51 112.39,37.47 WAS_D.2 | OK2.4 13.97,28.57 IMP-SWITCH.1 2.54,28.57 | OK3.4 13.97,15.24 REMOTE-SWITCH.1 2.54,15.24 2.54,28.57 | C11.1 PCB1.GND. 41.27,48.9 41.27,24.13 U$13.GND 43.18,18.41 C12.1 49.53,18.41 49.53,15.24 60.33,15.24 5V1.1 | C3.1 4.89,80.64 | 4.89,80.64 U1.2 7805.GND 21.59,80.64 | 73.66,37.47 v73.66,31.11 | 2.54,55.24 2.54,72.42 C10.1 4.9,80.63 4.89,80.64 | 2.54,55.24 2.54,41.91 | 2.54,41.91 2.54,28.57 | 2.54,41.91 STEER-SWITCH.1 13.97,41.91 | ON/OFF.1 109.22,91.76 107,93.98 v96.84,93.98 | OK4.4 13.97,55.24 ENCODER.1 2.54,55.24 | ADS1115.2 73.66,38.73 | ADS1115.5 v73.66,31.11 | 90.17,28.57 73.66,28.57 v73.66,31.11 | v20.32,44.45 16.51,44.45 13.97,41.91 | 13.97,41.91 OK1.4 | LED2.K LED1.K | 15V1.1 90.81,55.88 98.42,63.5 J3.3 112.39,63.5 112.39,49.53 IBT2.8 110.49,48.26 108.58,46.35 C8.1 | C6.1 21.59,80.64 | 21.59,80.64 C7.1 | C9.1 48.26,41.91 MMA8542.SAO
  Bottom 2.032: 73.66,38.73 73.66,37.47 | C8.1 v73.66,31.11
  other vias: 20.32,31.11 20.32,17.78 8.89,2.54 91.12,93.98 98.74,105.41 93.98,105.41 89.22,105.41 85.41,105.41 80.64,105.41 75.88,105.41 71.44,105.41 66.67,105.41 61.91,105.41 58.1,105.41 48.58,105.41 44.45,105.41 40.32,105.41 53.34,105.41 98.74,100.33 93.98,100.33 89.22,100.33 85.41,100.33 80.64,100.33 75.88,100.33 71.44,100.33 66.67,100.33 61.91,100.33 58.1,100.33 48.58,100.33 44.45,100.33 40.32,100.33 32.07,105.41 27.94,105.41 105.41,105.41 53.34,96.84 93.98,96.84 53.34,100.33 36.2,105.41 105.41,2.54 36.2,100.33 2.54,8.89 8.89,105.41 2.54,99.06 111.76,99.06 56.2,93.98 50.48,93.98 58.1,82.23 58.1,96.84 48.58,96.84 89.22,96.84 98.74,96.84 23.81,105.41 32.07,100.33 27.94,100.33 20.32,57.78 91.44,55.88 73.66,55.88 102.11,105.41 102.11,100.33 111.76,8.89 48.58,91.12 53.34,91.12 58.1,91.12 89.22,91.12 93.98,91.12 98.74,91.12 58.1,85.09 58.1,87.95 89.22,87.95 93.98,87.95 98.74,87.95 45.72,34.92 12.06,102.87 17.78,102.87 97.79,28.1 109.22,12.7 103.5,12.7 105.41,83.82 99.06,83.82 111.76,83.82 111.76,45.72 102.11,96.84 102.11,87.95 102.11,91.12 105.41,96.84 105.41,91.12 105.41,87.95 102.11,93.98 105.41,93.98 64.14,34.92
  pour Bottom (isolate 0.305, rank 2, no thermals): 48.26,74.93 59.69,74.93 66.04,68.58 96.52,68.58 97.79,69.85 97.79,83.82 99.06,85.09 111.76,85.09 113.03,83.82 113.03,45.09 111.76,43.81 67.63,43.81 66.04,42.23 66.04,17.46 67.63,15.88 111.76,15.88 113.03,14.61 113.03,2.54 111.76,1.27 3.81,1.27 1.27,3.81 1.27,104.14 3.81,106.68 110.49,106.68 113.03,104.14 113.03,87.63 111.76,86.36 89.53,86.36 88.27,87.63 88.27,96.52 86.36,98.42 60.96,98.42 59.05,96.52 59.05,77.47 57.78,76.2 48.9,76.2 46.35,78.74 46.35,91.44 45.09,91.44 45.09,78.11
  pour Bottom (isolate 0.305, no thermals): 113.03,41.91 111.76,43.18 67.94,43.18 66.67,41.91 66.67,17.78 67.94,16.51 111.76,16.51 113.03,17.78
  pour Top (isolate 0.305, no thermals): 113.03,41.91 111.76,43.18 67.94,43.18 66.67,41.91 66.67,17.78 67.94,16.51 111.76,16.51 113.03,17.78
  pour Top (isolate 0.305, rank 2, no thermals): 48.26,74.93 59.69,74.93 66.04,68.58 96.52,68.58 97.79,69.85 97.79,83.82 99.06,85.09 111.76,85.09 113.03,83.82 113.03,45.09 111.76,43.81 67.63,43.81 66.04,42.23 66.04,17.46 67.63,15.88 111.76,15.88 113.03,14.61 113.03,2.54 111.76,1.27 3.81,1.27 1.27,3.81 1.27,104.14 3.81,106.68 110.49,106.68 113.03,104.14 113.03,87.63 111.76,86.36 89.53,86.36 88.27,87.63 88.27,96.52 86.36,98.42 60.96,98.42 59.05,96.52 59.05,77.47 57.78,76.2 48.9,76.2 46.35,78.74 46.35,91.44 45.09,91.44 45.09,78.11
HIGH
  Top 0.406: R11.2 86.36,34.92 C14.2 77.47,26.04 ADS1115.7
HIGH.
  Top 0.406: WAS_D.3 R11.1
LOW
  Top 0.406: ADS1115.8 77.47,23.5 C13.2 86.36,32.38 R10.2
LOW.
  Top 0.406: WAS_D.4 R10.1
N$1
  Top 0.508: D5.C 5.08,64.77 ENCODER.3
N$2
  Top 0.406: R2.1 14.8,37.78 16.51,39.5 OK1.5
N$3
  Bottom 0.61: OK1.2 16.51,46.99 13.97,44.45 STEER-SWITCH.2
N$4
  Bottom 0.61: OK2.2 16.51,33.66 13.97,31.11 IMP-SWITCH.2
N$5
  Top 0.61: D6.A D1.A 107.63,77.15 96.69,66.21 K4.86
N$6
  Top 0.406: R1.1 14.8,24.45 16.51,26.16 OK2.5
N$7
  Top 0.406: R5.1 86.36,20.95 C1.2 80.01,22.23 76.2,18.41 ADS1115.10
N$8
  Top 0.406: ADS1115.9 76.2,20.95 80.01,24.77 C2.2 86.36,23.5 R14.1
N$9
  Bottom 0.61: ENCODER.2 13.97,57.78 16.51,60.33 OK4.2
N$10
  Top 0.406: AUX_A/D.2 R5.2
N$11
  Top 0.406: AUX_A/D.3 R14.2
N$12
  Bottom 0.61: OK3.2 16.51,20.32 13.97,17.78 REMOTE-SWITCH.2
N$13
  Top 0.406: LED2.A R16.2
N$14
  Top 0.406: LED1.A R17.2
N$15
  Top 0.406: R3.1 14.8,11.11 16.51,12.83 OK3.5
N$16
  Top 0.508: R13.2 14.61,31.11 16.51,31.11 19.05,33.66 OK2.1
N$17
  Top 0.508: OK3.1 19.05,20.32 16.51,17.78 14.61,17.78 R18.2
N$18
  Top 0.508: OK1.1 19.05,46.99 16.51,44.45 14.61,44.45 R12.2
N$22
  Bottom 0.406: R6.2 52.07,59.69 LED3.A
N$23
  Bottom 0.406: R21.1 67.31,59.69 LED5.A
N$26
  Top 0.813: C3.2 | C3.2 U1.1 | 7805.IN C6.2 C5.2
  Top 1.016: D2.C D3.C 38.06,91.48 16.55,91.48 C5.2 15.24,92.71 C15.+ 9.97,92.52 C3.2
N$28
  Top 0.61: ON/OFF.2 109.22,83.82 106.68,81.28 D6.C
N$29
  Top 0.406: OK4.5 16.51,52.7 14.92,51.12 R22.1
N$30
  Top 0.508: R23.2 14.61,57.78 16.51,57.78 19.05,60.33 OK4.1
N$31
  Bottom 0.406: R7.2 59.69,59.69 LED4.A
PWM1
  Top 0.406: J3.2 110.49,66.04 111.76,64.77 111.76,58.42 IBT2.2 108.58,59.05 105.41,59.05 101.6,55.24 R8.1
PWM2
  Top 0.406: R19.1 104.08,52.01 104.08,55.05 106.17,57.15 IBT2.1
RST
  Top 0.406: PCB1.RST. 45.85,46.35 46.48,46.99 RST.2
SCL
  Top 0.406: PCB1.A5 52.07,36.2 R25.1 54.61,36.2 ADS1115.3
  Bottom 0.406: MMA8542.SCL R25.1 57.78,34.92 62.87,29.84 TO_SECTION.2
SCL.
  Top 0.406: R25.2 50.8,24.77 U$13.SCL
SDA
  Top 0.406: ADS1115.4 52.07,33.66 R20.1 49.53,33.66 PCB1.A4
  Bottom 0.406: MMA8542.SDA R20.1 50.8,33.02 60.33,23.5 TO_SECTION.1
SDA.
  Bottom 0.406: R20.2 53.34,24.77 U$13.SDA
V+  (via drill 0.51, 2.8 pad 5)
  Top 0.61: D1.C 99.18,77.15 99.12,77.09 94.61,77.09 92.77,75.25 K4.87
  other vias: 83.5,93.98 77.79,93.98 80.64,73.66 89.22,76.52 80.64,79.38 93.98,79.38 80.64,82.23 80.64,96.84 85.41,79.38 93.98,76.52 80.64,76.52 89.22,79.38 89.22,73.66 93.98,70.8 89.22,70.8 75.88,82.23 75.88,96.84 85.41,96.84 80.64,70.8 89.28,82.23 75.88,91.12 80.64,91.12 85.41,91.12 93.99,82.23 75.88,85.09 80.64,85.09 85.41,85.09 75.88,87.95 80.64,87.95 85.41,87.95
  pour Top (no thermals): 96.52,71.12 95.25,69.85 80.64,69.85 79.38,71.12 79.38,76.83 74.3,81.92 74.3,95.89 75.56,97.16 85.72,97.16 87,95.89 87,87.31 89.22,85.09 95.25,85.09 96.52,83.82
  pour Bottom (no thermals): 96.52,71.12 95.25,69.85 80.64,69.85 79.38,71.12 79.38,76.83 74.3,81.92 74.3,95.89 75.56,97.16 85.72,97.16 87,95.89 87,87.31 89.22,85.09 95.25,85.09 96.52,83.82

### Text on the board
Bottom: pcb layout Petar Starcev Serbia, Novi Sad
tPlace: AutoSteer Button / put 1k resistors / Autosteer Switch / do not put / the 1k resistors
tNames: AGOpenGPS | GND | GND | AutoSteer | MOTOR | POWER | VX7805-1000 | LM7805 | MD10C | MD13S | DIR | D4 | 5V / ok | PWM | D3 | GND | GND | 15V | 15V | 1k | 1k | 5V | 5V | D2 | EA | Power / out | RPWM | LPWM | GND | GND | En | En | REMOTE / SWITCH | WORK / SWITCH | STEER / SWITCH | GND | GND | STEER / SWITCH | VCC | GND | 15V | BRN | D6 | BLK | .1uF | W.A.S. | GND | BLU | 5V | 5V | WORK / SWITCH | GND | GND | HI | A0 | 15V | BRN | LO | A1 | D7 | BLK | GND | BLU | AUX A/D | AGND | GND | GND | A4 | A5 | REMOTE / SWITCH | REMOTE / SWITCH | SDA | SCL | 1 | AUX | A2 | 2 | AUX | A3 | 15V | BRN | .1uF | D8 | BLK | GND | GND | GND | 5V | GND | BLU | or / ENCODER | 5V | 5V | GND | GND | 5V | GND | A7 | A6 | A3 | A2 | A1 | A0 | D5 | GND | GND | GND
bNames: AGOpenGPS | AutoSteer | GND | +15V | +15V MAX | GND | MOTOR | POWER